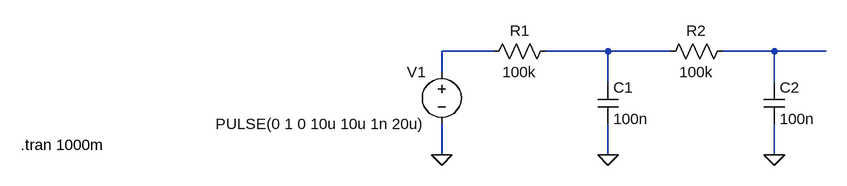
[diagram p0: schematic 801_PWM_DAC.asc]
801_PWM_DAC.asc, the LTspice schematic file:
Version 4
SHEET 1 2616 1748
WIRE 96 128 16 128
WIRE 272 128 176 128
WIRE 368 128 272 128
WIRE 528 128 448 128
WIRE 608 128 528 128
WIRE 16 160 16 128
WIRE 272 176 272 128
WIRE 528 176 528 128
WIRE 16 288 16 240
WIRE 272 288 272 240
WIRE 528 288 528 240
FLAG 272 288 0
FLAG 16 288 0
FLAG 528 288 0
SYMBOL res 192 112 R90
WINDOW 0 0 56 VBottom 2
WINDOW 3 32 56 VTop 2
SYMATTR InstName R1
SYMATTR Value 100k
SYMBOL cap 256 176 R0
SYMATTR InstName C1
SYMATTR Value 100n
SYMBOL voltage 16 144 M0
WINDOW 123 0 0 Left 0
WINDOW 39 0 0 Left 0
SYMATTR InstName V1
SYMATTR Value PULSE(0 1 0 10u 10u 1n 20u)
SYMBOL res 464 112 R90
WINDOW 0 0 56 VBottom 2
WINDOW 3 32 56 VTop 2
SYMATTR InstName R2
SYMATTR Value 100k
SYMBOL cap 512 176 R0
SYMATTR InstName C2
SYMATTR Value 100n
TEXT -632 272 Left 2 !.tran 1000m

The netlist it stands for:
* 801_PWM_DAC.asc
R1 N002 N001 100k
C1 N002 0 100n
V1 N001 0 PULSE(0 1 0 10u 10u 1n 20u)
R2 N003 N002 100k
C2 N003 0 100n
.tran 1000m
.backanno
.end